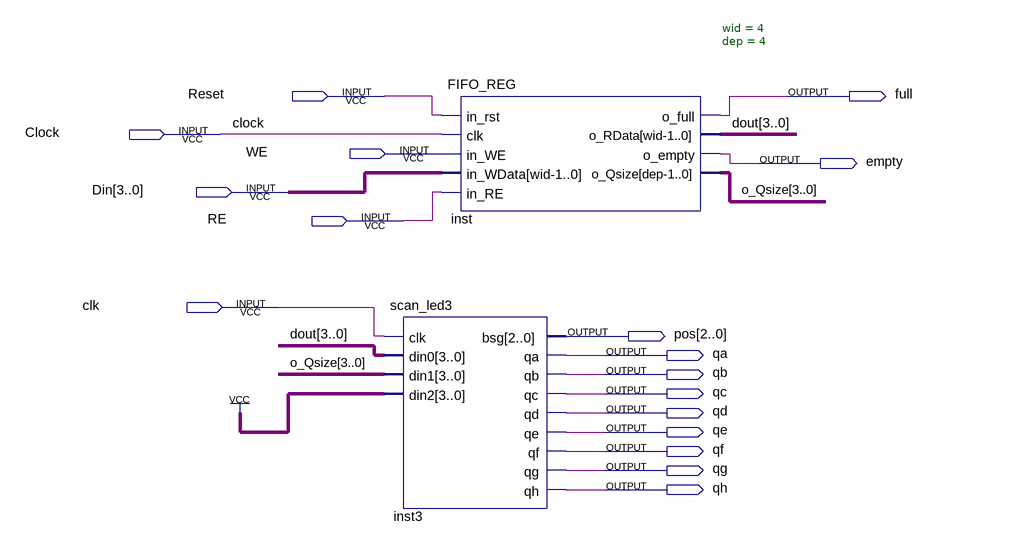
[diagram p0: schematic sheet]
// Quartus schematic FIFO_TEST.bdf as structural Verilog: 2 symbols, 17 pins
module FIFO_TEST (
  input  Reset,
  input  Clock,
  input  WE,
  input  [3:0] Din,
  input  RE,
  input  clk,
  output full,
  output empty,
  output [2:0] pos,
  output qa,
  output qb,
  output qc,
  output qd,
  output qe,
  output qf,
  output qg,
  output qh
);

  wire [3:0] dout, o_Qsize;

  scan_led3 inst3 (
    .clk(clk), .din0(dout), .din1(o_Qsize), .din2(4'b1111), .bsg(pos), .qa(qa), .qb(qb), .qc(qc), .qd(qd),
    .qe(qe), .qf(qf), .qg(qg), .qh(qh));
  FIFO_REG #(.wid(4), .dep(4)) inst (
    .in_rst(Reset), .clk(Clock), .in_WE(WE), .in_WData(Din), .in_RE(RE), .o_full(full), .o_RData(dout),
    .o_empty(empty), .o_Qsize(o_Qsize));
endmodule
